# Altium schematic sheet ANALOG_TRIAC.SchDoc
size A3
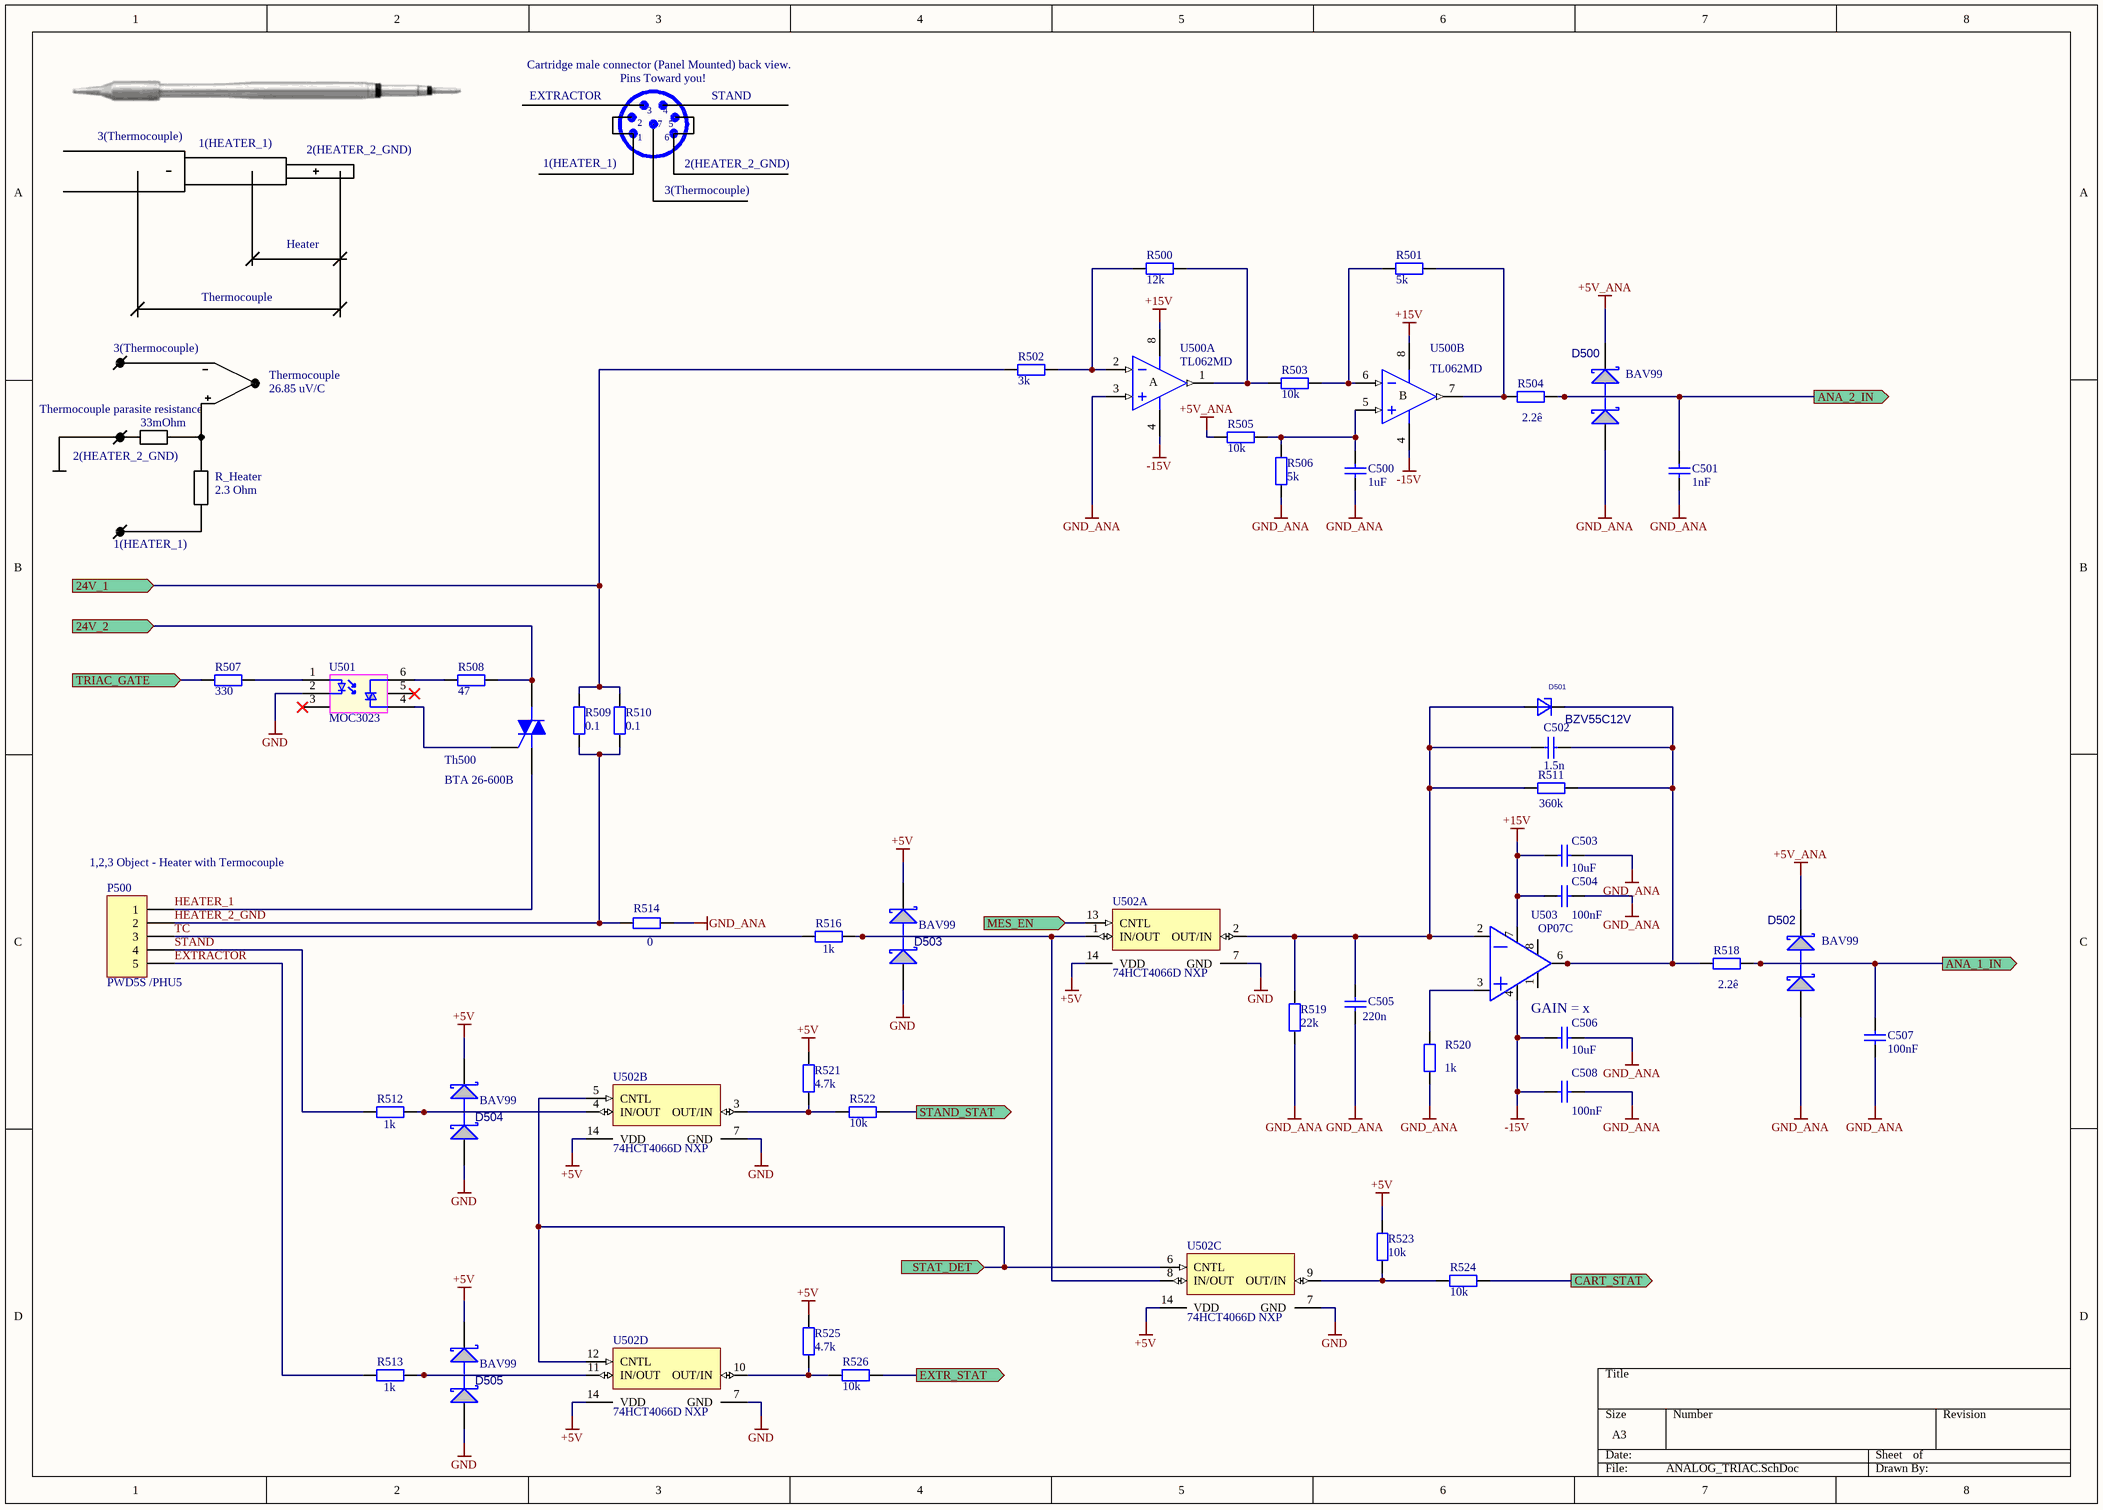
[diagram p0: ANALOG_TRIAC.SchDoc]

## Parts
C500  value 1uF  [3216[1206]]  (hidden comment: Cap 1206)
C501  value 1nF  [3216[1206]]  (hidden comment: Cap 1206)
C502  value 1.5n  [3216[1206]]  (hidden comment: Cap 1206)
C503  value 10uF  [3216[1206]]  (hidden comment: Cap 1206)
C504  value 100nF  [3216[1206]]  (hidden comment: Cap 1206)
C505  value 220n  [3216[1206]]  (hidden comment: Cap 1206)
C506  value 10uF  [3216[1206]]  (hidden comment: Cap 1206)
C507  value 100nF  [3216[1206]]  (hidden comment: Cap 1206)
C508  value 100nF  [3216[1206]]  (hidden comment: Cap 1206)
D500  value BAV99  [SOT23_HIS_Primary]  (hidden comment: BAT64-04)
D501  BZV55C12V  [D_MINIMELF_BZV55C12V(Primary)]
D502  value BAV99  [SOT23_HIS_Primary]  (hidden comment: BAT64-04)
D503  value BAV99  [SOT23_HIS_Primary]  (hidden comment: BAT64-04)
D504  value BAV99  [SOT23_HIS_Primary]  (hidden comment: BAT64-04)
D505  value BAV99  [SOT23_HIS_Primary]  (hidden comment: BAT64-04)
P500  PWD5S /PHU5  [PWD5S/ PHU5]
R500  value 12k  [1206_REFLOW]  (hidden comment: RES)
R501  value 5k  [1206_REFLOW]  (hidden comment: RES)
R502  value 3k  [1206_REFLOW]  (hidden comment: RES)
R503  value 10k  [1206_REFLOW]  (hidden comment: RES)
R504  value 2.2ê  [3216[1206]]  (hidden comment: RES)
R505  value 10k  [1206_REFLOW]  (hidden comment: RES)
R506  value 5k  [1206_REFLOW]  (hidden comment: RES)
R507  value 330  [3216[1206]]  (hidden comment: RES)
R508  value 47  [3216[1206]]  (hidden comment: RES)
R509  value 0.1  [RA161004]  (hidden comment: RES)
R510  value 0.1  [RA161004]  (hidden comment: RES)
R511  value 360k  [3216[1206]]  (hidden comment: RES)
R512  value 1k  [3216[1206]]  (hidden comment: RES)
R513  value 1k  [3216[1206]]  (hidden comment: RES)
R514  value 0  [1206_REFLOW]  (hidden comment: RES)
R516  value 1k  [3216[1206]]  (hidden comment: RES)
R518  value 2.2ê  [3216[1206]]  (hidden comment: RES)
R519  value 22k  [3216[1206]]  (hidden comment: RES)
R520  value 1k  [3216[1206]]  (hidden comment: RES)
R521  value 4.7k  [3216[1206]]  (hidden comment: RES)
R522  value 10k  [3216[1206]]  (hidden comment: RES)
R523  value 10k  [3216[1206]]  (hidden comment: RES)
R524  value 10k  [3216[1206]]  (hidden comment: RES)
R525  value 4.7k  [3216[1206]]  (hidden comment: RES)
R526  value 10k  [3216[1206]]  (hidden comment: RES)
Th500  BTA 26-600B  [TO247]
U500  TL062MD  [SO8_N]  (parts A,B of 2)
U501  MOC3023  [DIP-6]
U502  74HCT4066D NXP  [SO14_N]  (parts A,B,C,D of 4)
U503  OP07C  [SO8]

## Ports
24V_1 (in), 24V_2 (in), ANA_1_IN (out), ANA_2_IN (out), CART_STAT (out), EXTR_STAT (out), MES_EN (in), STAND_STAT (out), STAT_DET (in), TRIAC_GATE (in)

## Nets
+5V: D503.2(K) D504.2(K) D505.2(K) R521.2 R523.2 R525.2 U502.14(VDD)  [also labelled VDD]
+5V_ANA: D500.2(K) D502.2(K) R505.1
+15V: C503.2 C504.2 U500.8(V+) U503.7
-15V: C506.2 C508.2 U500.4(V-) U503.4
GND: D503.1(A) D504.1(A) D505.1(A) U501.2 U502.7(GND)
GND_ANA: C500.1 C501.1 C503.1 C504.1 C505.1 C506.1 C507.1 C508.1 D500.1(A) D502.1(A) R506.1 R514.2 R519.2 R520.2 U500.3(IN+)
24V_1: R502.1 R509.1 R510.1 ; port 24V_1
24V_2: R508.2 Th500.2 ; port 24V_2
ANA_1_IN: C507.2 D502.3(C) R518.2 ; port ANA_1_IN
ANA_2_IN: C501.2 D500.3(C) R504.2 ; port ANA_2_IN
CART_STAT: R524.2 ; port CART_STAT
EXTR_STAT: R526.2 ; port EXTR_STAT
EXTRACTOR: P500.5 R513.1
HEATER_1: P500.1 Th500.1
HEATER_2_GND: P500.2 R509.2 R510.2 R514.1
MES_EN: U502.13(CNTL) ; port MES_EN
STAND: P500.4 R512.1
STAND_STAT: R522.2 ; port STAND_STAT
STAT_DET: U502.5(CNTL) U502.6(CNTL) U502.12(CNTL) ; port STAT_DET
TC: P500.3 R516.1
TRIAC_GATE: R507.1 ; port TRIAC_GATE
NetC500_2: C500.2 R505.2 R506.2 U500.5(IN+)
NetC502_1: C502.1 D501.K R511.2 R518.1 U503.6
NetC502_2: C502.2 C505.2 D501.A R511.1 R519.1 U502.2(OUT/IN) U503.2
NetD503_3: D503.3(C) R516.2 U502.1(IN/OUT) U502.8(IN/OUT)
NetD504_3: D504.3(C) R512.2 U502.4(IN/OUT)
NetD505_3: D505.3(C) R513.2 U502.11(IN/OUT)
NetR500_1: R500.1 R502.2 U500.2(IN-)
NetR500_2: R500.2 R503.1 U500.1(OUT)
NetR501_1: R501.1 R503.2 U500.6(IN-)
NetR501_2: R501.2 R504.1 U500.7(OUT)
NetR507_2: R507.2 U501.1
NetR508_1: R508.1 U501.6
NetR520_1: R520.1 U503.3
NetR521_1: R521.1 R522.1 U502.3(OUT/IN)
NetR523_1: R523.1 R524.1 U502.9(OUT/IN)
NetR525_1: R525.1 R526.1 U502.10(OUT/IN)
NetTh500_3: Th500.3 U501.4

Not connected (* = marked no-connect by the designer): U501 3* 5*; U503 1 8

## Notes on the sheet
- Cartridge male connector (Panel Mounted) back view.
- EXTRACTOR
- Pins Toward you!
- 3
- 4
- STAND
- 3(Thermocouple)
- 1(HEATER_1)
- 2(HEATER_2_GND)
- 1
- 2
- 7
- 6
- 5
- Heater
- Thermocouple
- Thermocouple parasite resistance
- 33mOhm
- 26.85 uV/C
- 2.3 Ohm
- R_Heater
- (near P500) 1,2,3 Object - Heater with Termocouple
- GAIN = x
- (in symbol TL062MD, part A) A
- (in symbol TL062MD, part B) B

## Library data of the parts
D500 D502-D505 = BAT64-04: Silicon Schottky Diodes; Manufacturer: INF; ComponentLink1DescBC: Manufacturer Link; Group: Discrete; Subgroup: Diode; Published: 21-Mar-2003; DatasheetDocument: Oct-1999; PackageDocument: Sep-2001; PackageReference: SOT-23; Publisher: Altium Limited; ComponentLink1URL: http://www.infineon.com/
R500-R514 R516 R518-R526 = RES 1
U500 = TL062MD: Low-Power J-FET Dual Bipolar Operational Amplifier; Published: 24-Aug-2001; LatestRevisionDate: 13-Apr-2006; LatestRevisionNote: IPC-7351 Footprint Added.; DatasheetVersion: Oct-1997; PackageVersion: Dec-2002; PackageReference: SO8; Publisher: Altium Limited; PackageDescription: 8-Pin Small Outline Integrated Circuit 1.27 mm Pitch; Code_JEDEC: MS-012-AA; Code_IPC: SOIC127P600-8; ComponentLink1Description: Manufacturer Link; ComponentLink1URL: http://www.st.com/; ComponentLink2Description: Datasheet; ComponentLink2URL: http://www.st.com/stonline/products/literature/ds/2294/tl062.pdf
U502 = HCF4066BM1: Quad Bilateral Switch For Transmission or Multiplexing of Analog or Digital Signals; Published: 8-Jun-2000; LatestRevisionDate: 13-Apr-2006; LatestRevisionNote: IPC-7351 Footprint Added.; DatasheetVersion: Jun-1989; PackageVersion: Sep-1998; PackageReference: SO14; Publisher: Altium Limited; PackageDescription: 14-Pin Small Outline Integrated Circuit 1.27 mm Pitch; Code_IPC: SOIC127P600-14; ComponentLink1Description: Manufacturer Link; ComponentLink1URL: http://www.st.com/; ComponentLink2Description: Datasheet; ComponentLink2URL: http://www.st.com/stonline/products/literature/ds/2057/hcf4066.pdf
D501 = BZV55C12V: Value: BZV55C12V
P500 = PWD5S /PHU5: Value: PWD5S /PHU5
Th500 = BTA 26-600B: Value: BTA 26-600B
U501 = MOC3023: Value: MOC3023
U503 = OP07C: Value: OP07C